# Altium schematic sheet CtrlCarbinBoard_Processor.SchDoc
size A3
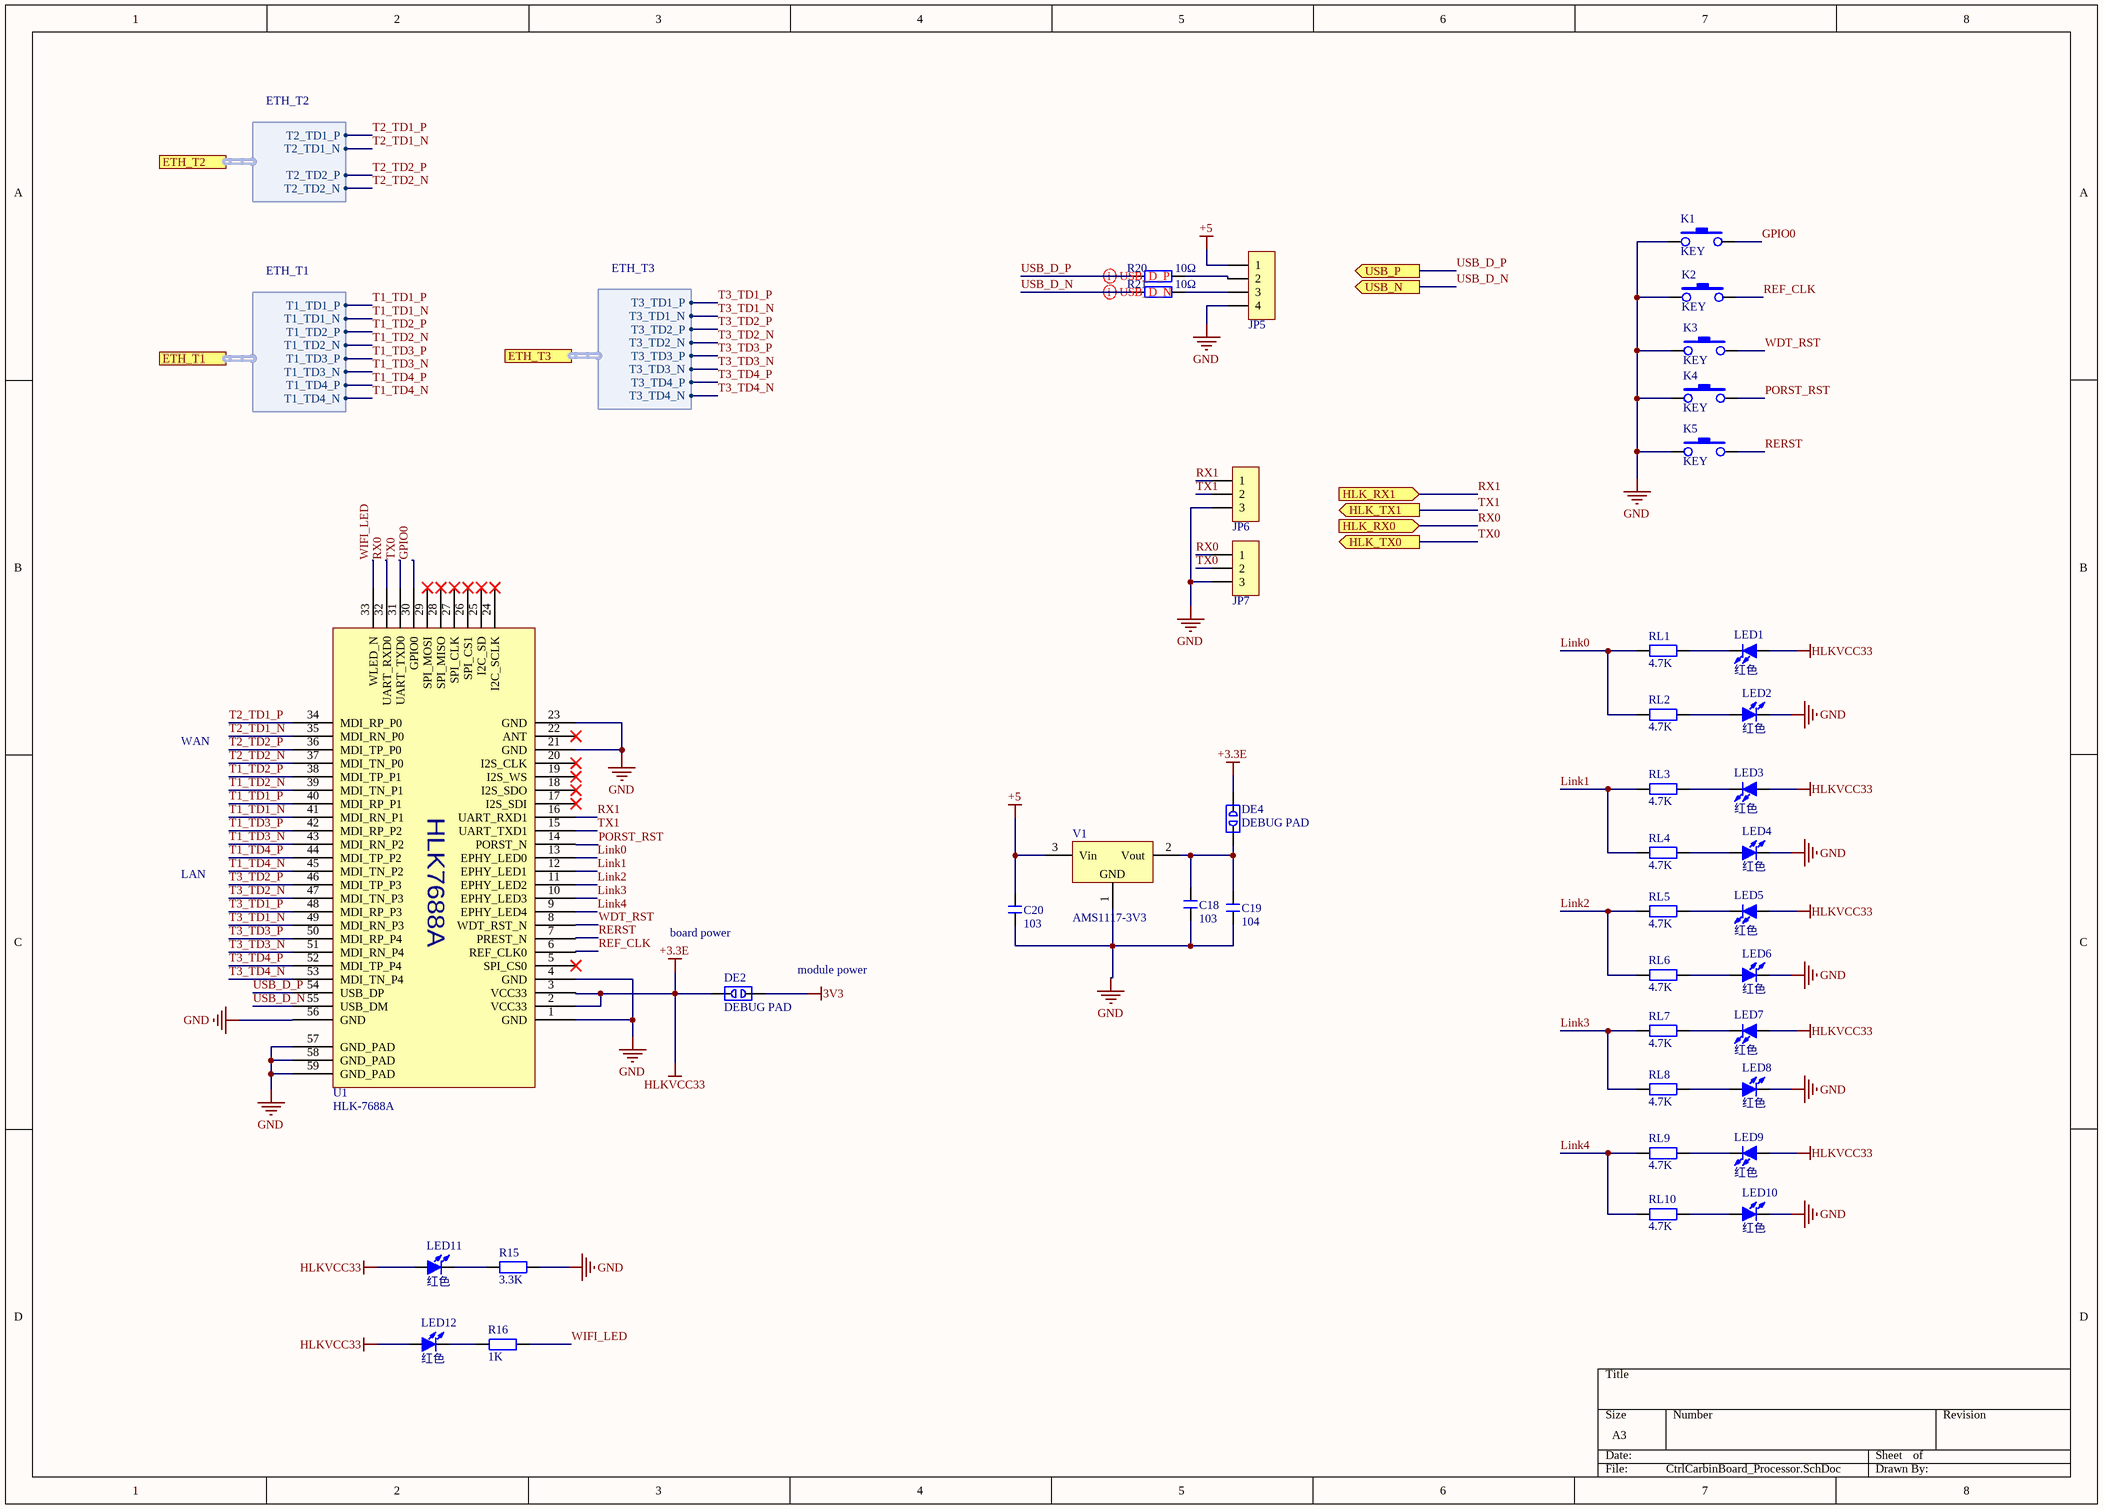
[diagram p0: CtrlCarbinBoard_Processor.SchDoc]

## Parts
C18  103  [C 0603_L]
C19  104  [C 0603_L]
C20  103  [C 0603_L]
DE2  DEBUG PAD  [DEBUG_B]
DE4  DEBUG PAD  [DEBUG_B]
JP5  HDR-1X4  [HDR2.54-LI-4P]  (value not drawn)
JP6  HDR-1X3  [PH2.0-LS-3P]  (value not drawn)
JP7  HDR-1X3  [PH2.0-LS-3P]  (value not drawn)
K1  KEY  [SMD-3X6X2.5]
K2  KEY  [SMD-3X6X2.5]
K3  KEY  [SMD-3X6X2.5]
K4  KEY  [SMD-3X6X2.5]
K5  KEY  [SMD-3X6X2.5]
LED1  红色  [LED 0603R]
LED2  红色  [LED 0603R]
LED3  红色  [LED 0603R]
LED4  红色  [LED 0603R]
LED5  红色  [LED 0603R]
LED6  红色  [LED 0603R]
LED7  红色  [LED 0603R]
LED8  红色  [LED 0603R]
LED9  红色  [LED 0603R]
LED10  红色  [LED 0603R]
LED11  红色  [LED 0805G]
LED12  红色  [LED 0805G]
R15  3.3K  [R 0603_L]
R16  1K  [R 0603_L]
R20  10Ω  [R 0603_L]
R21  10Ω  [R 0603_L]
RL1  4.7K  [R 0603_L]
RL2  4.7K  [R 0603_L]
RL3  4.7K  [R 0603_L]
RL4  4.7K  [R 0603_L]
RL5  4.7K  [R 0603_L]
RL6  4.7K  [R 0603_L]
RL7  4.7K  [R 0603_L]
RL8  4.7K  [R 0603_L]
RL9  4.7K  [R 0603_L]
RL10  4.7K  [R 0603_L]
U1  HLK-7688A  [7688A]
V1  AMS1117-3V3  [SOT223_M]

## Ports
ETH_T1 (harness ETH_T1), ETH_T2 (harness ETH_T2), ETH_T3 (harness ETH_T3), HLK_RX0 (in), HLK_RX1 (in), HLK_TX0 (out), HLK_TX1 (out), USB_N (out), USB_P (out)

## Harnesses
ETH_T1: T1_TD1_P, T1_TD1_N, T1_TD2_P, T1_TD2_N, T1_TD3_P, T1_TD3_N, T1_TD4_P, T1_TD4_N
ETH_T2: T2_TD1_P, T2_TD1_N, T2_TD2_P, T2_TD2_N
ETH_T3: T3_TD1_P, T3_TD1_N, T3_TD2_P, T3_TD2_N, T3_TD3_P, T3_TD3_N, T3_TD4_P, T3_TD4_N

## Nets
3V3: DE2.2
+3.3E: DE2.1 DE4.2 LED1.1(A) LED3.1(A) LED5.1(A) LED7.1(A) LED9.1(A) LED11.1(A) LED12.1(A) U1.2(VCC33) U1.3(VCC33)  [also labelled HLKVCC33]
+5: C20.2 JP5.1 V1.3(Vin)
GND: C18.1 C19.1 C20.1 JP5.4 JP6.3 JP7.3 K1.1 K2.1 K3.1 K4.1 K5.1 LED2.2(K) LED4.2(K) LED6.2(K) LED8.2(K) LED10.2(K) R15.2 U1.1(GND) U1.4(GND) U1.21(GND) U1.23(GND) U1.56(GND) U1.57(GND_PAD) U1.58(GND_PAD) U1.59(GND_PAD) V1.1(GND)
GPIO0: K1.3 U1.30(GPIO0)
Link0: RL1.2 RL2.2 U1.13(EPHY_LED0)
Link1: RL3.2 RL4.2 U1.12(EPHY_LED1)
Link2: RL5.2 RL6.2 U1.11(EPHY_LED2)
Link3: RL7.2 RL8.2 U1.10(EPHY_LED3)
Link4: RL9.2 RL10.2 U1.9(EPHY_LED4)
PORST_RST: K4.3 U1.14(PORST_N)
REF_CLK: K2.3 U1.6(REF_CLK0)
RERST: K5.3 U1.7(PREST_N)
RX0: JP7.1 U1.32(UART_RXD0) ; port HLK_RX0
RX1: JP6.1 U1.16(UART_RXD1) ; port HLK_RX1
T1_TD1_N: U1.41(MDI_RN_P1) ; port ETH_T1.T1_TD1_N
T1_TD1_P: U1.40(MDI_RP_P1) ; port ETH_T1.T1_TD1_P
T1_TD2_N: U1.39(MDI_TN_P1) ; port ETH_T1.T1_TD2_N
T1_TD2_P: U1.38(MDI_TP_P1) ; port ETH_T1.T1_TD2_P
T1_TD3_N: U1.43(MDI_RN_P2) ; port ETH_T1.T1_TD3_N
T1_TD3_P: U1.42(MDI_RP_P2) ; port ETH_T1.T1_TD3_P
T1_TD4_N: U1.45(MDI_TN_P2) ; port ETH_T1.T1_TD4_N
T1_TD4_P: U1.44(MDI_TP_P2) ; port ETH_T1.T1_TD4_P
T2_TD1_N: U1.35(MDI_RN_P0) ; port ETH_T2.T2_TD1_N
T2_TD1_P: U1.34(MDI_RP_P0) ; port ETH_T2.T2_TD1_P
T2_TD2_N: U1.37(MDI_TN_P0) ; port ETH_T2.T2_TD2_N
T2_TD2_P: U1.36(MDI_TP_P0) ; port ETH_T2.T2_TD2_P
T3_TD1_N: U1.49(MDI_RN_P3) ; port ETH_T3.T3_TD1_N
T3_TD1_P: U1.48(MDI_RP_P3) ; port ETH_T3.T3_TD1_P
T3_TD2_N: U1.47(MDI_TN_P3) ; port ETH_T3.T3_TD2_N
T3_TD2_P: U1.46(MDI_TP_P3) ; port ETH_T3.T3_TD2_P
T3_TD3_N: U1.51(MDI_RN_P4) ; port ETH_T3.T3_TD3_N
T3_TD3_P: U1.50(MDI_RP_P4) ; port ETH_T3.T3_TD3_P
T3_TD4_N: U1.53(MDI_TN_P4) ; port ETH_T3.T3_TD4_N
T3_TD4_P: U1.52(MDI_TP_P4) ; port ETH_T3.T3_TD4_P
TX0: JP7.2 U1.31(UART_TXD0) ; port HLK_TX0
TX1: JP6.2 U1.15(UART_TXD1) ; port HLK_TX1
USB_D_N: R21.1 U1.55(USB_DM) ; port USB_N
USB_D_P: R20.1 U1.54(USB_DP) ; port USB_P
WDT_RST: K3.3 U1.8(WDT_RST_N)
WIFI_LED: R16.2 U1.33(WLED_N)
NetC18_2: C18.2 C19.2 DE4.1 V1.2(Vout)
NetJP5_2: JP5.2 R20.2
NetJP5_3: JP5.3 R21.2
NetLED1_2: LED1.2(K) RL1.1
NetLED2_1: LED2.1(A) RL2.1
NetLED3_2: LED3.2(K) RL3.1
NetLED4_1: LED4.1(A) RL4.1
NetLED5_2: LED5.2(K) RL5.1
NetLED6_1: LED6.1(A) RL6.1
NetLED7_2: LED7.2(K) RL7.1
NetLED8_1: LED8.1(A) RL8.1
NetLED9_2: LED9.2(K) RL9.1
NetLED10_1: LED10.1(A) RL10.1
NetLED11_2: LED11.2(K) R15.1
NetLED12_2: LED12.2(K) R16.1

Not connected (* = marked no-connect by the designer): U1 5(SPI_CS0)* 17(I2S_SDI)* 18(I2S_SDO)* 19(I2S_WS)* 20(I2S_CLK)* 22(ANT)* 24(I2C_SCLK)* 25(I2C_SD)* 26(SPI_CS1)* 27(SPI_CLK)* 28(SPI_MISO)* 29(SPI_MOSI)*

## Layout directives
differential pair: USB_D_N, USB_D_P

## Notes on the sheet
- WAN
- LAN
- (near DE2) board power
- module power
- (in symbol HLK-7688A) HLK7688A

## Library data of the parts
C18-C20 = C: 无极性贴片电容; 版权归属: 源创客; BOM名称: 无极性贴片电容; 学习资源: www.ooocke.com
DE2 DE4 = DEBUG: 调试断点焊盘; 版权归属: 源创客; BOM名称: 调试断点焊盘; 学习资源: www.ooocke.com
JP5 = Header 4: 4P接插件; 版权归属: 源创客; BOM名称: 4P接插件; 学习资源: www.ooocke.com
JP6 JP7 = Header 3: 3P接插件; 版权归属: 源创客; BOM名称: 3P接插件; 学习资源: www.ooocke.com
LED1-LED12 = LED-SMD: 贴片LED; 版权归属: 源创客; BOM名称: 贴片LED; 学习资源: www.ooocke.com
R15 R16 R20 R21 RL1-RL10 = R: 贴片电阻; 版权归属: 源创客; BOM名称: 贴片电阻; 学习资源: www.ooocke.com
V1 = AMS1117: 三端稳压芯片; BOM名称: 稳压芯片; 版权归属: 源创客; 学习资源: www.ooocke.com